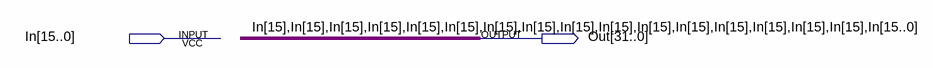
[diagram p0: schematic sheet]
// Quartus schematic signExtender.bdf as structural Verilog: 0 symbols, 2 pins
module signExtender (
  input  [15:0] In,
  output [31:0] Out
);


  assign Out = {{17{In[15]}}, In[14:0]};
endmodule
